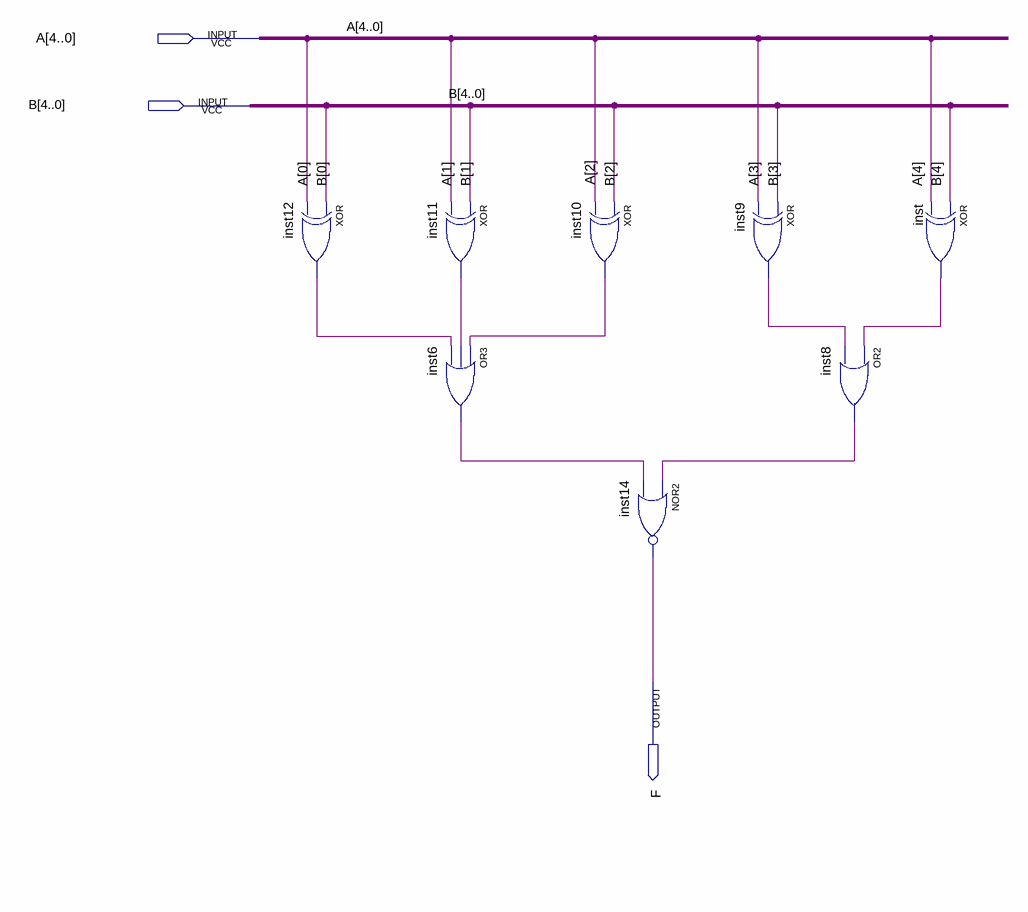
[diagram p0: schematic sheet]
// Quartus schematic projeto.bdf as structural Verilog: 8 symbols, 3 pins
module projeto (
  input  [4:0] A,
  input  [4:0] B,
  output F
);

  wire inst6_out, inst8_out, inst9_out, inst10_out, inst11_out, inst12_out, inst_out;

  xor inst12 (inst12_out, B[0], A[0]);
  xor inst11 (inst11_out, B[1], A[1]);
  or inst6 (inst6_out, inst10_out, inst11_out, inst12_out);
  xor inst10 (inst10_out, B[2], A[2]);
  nor inst14 (F, inst8_out, inst6_out);
  xor inst9 (inst9_out, B[3], A[3]);
  or inst8 (inst8_out, inst_out, inst9_out);
  xor inst (inst_out, B[4], A[4]);
endmodule
